# EAGLE design mcp661 (EAGLE 9.4.2)
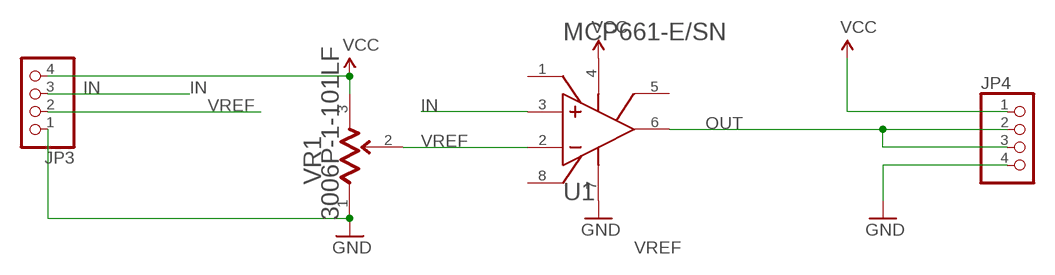
[diagram p0: schematic, sheet 1]

## Parts
JP3  PINHD-1X4  [1X04]
JP4  PINHD-1X4  [1X04]
U1  MICROCHIP_MCP661-E-SNMICROCHIP_MCP661-E-SN_0_2  [MICROCHIP_MCP661-E-SN_2]
VR1  BOURNS_3006P-1-101LFBOURNS_3006P-1-101LF_0_0  [BOURNS_3006P-1-101LF_0]

## Nets
GND: JP3.1 JP4.4 U1.7(VDD) VR1.1(CCW)
IN: JP3.3 U1.3(VIN+)
OUT: JP4.2 JP4.3 U1.6(VOUT)
VCC: JP3.4 JP4.1 U1.4(VSS) VR1.3(CW)
VREF: JP3.2 U1.2(VIN-) VR1.2(WIPER)
Unconnected: U1.1(1_NC) U1.5(2_NC) U1.8(3_NC)

## Library data of the parts
JP3 JP4 = pinhead:PINHD-1X4: PIN HEADER
U1 = SN:MICROCHIP_MCP661-E-SN: AMP-OPA-MCP601-IL8; CIIVA_IDS: 1325176; CODE__IPC: SOIC127P600-8; CODE__JEDEC: MS-012; COMPONENT_LINK_1_DESCRIPTION: Manufacturer URL; COMPONENT_LINK_1_URL: http://www.microchip.com/; COMPONENT_LINK_3_DESCRIPTION: Package Specification; COMPONENT_LINK_3_URL: http://www.microchip.com/stellent/groups/techpub_sg/documents/packagingspec/en012702.pdf; DATASHEET: http://ww1.microchip.com/downloads/en/DeviceDoc/22194C.pdf; DATASHEET_VERSION: revC, Nov-2011; FOOTPRINT_VARIANT_NAME_0: Level C; FOOTPRINT_VARIANT_NAME_1: Level B; FOOTPRINT_VARIANT_NAME_2: Level A; IMPORTED: yes; IMPORTED_FROM: vault; IMPORT_TS: 1521851511; MF: Microchip; MPN: MCP661-E/SN; PACKAGE: SOIC-SN8; PACKAGE_DESCRIPTION: 8-Lead Plastic Small Outline (SN) - Narrow, 3.90mm Body [SOIC]; PACKAGE_VERSION: revBB, Aug-2009; PREFIX: U; RELEASE_DATE: 1331952694; VAULT_GUID: 973559BF-ABD0-425F-8F5C-143CC353DD3C; VAULT_REVISION: DF713E88-1BB5-4496-A0BE-75F4F4915CB1
VR1 = Bourns - 3006P-1-101LF:BOURNS_3006P-1-101LF: Trimpot® Trimming Potentiometer; CAPACITANCE: TRIMMER 100 OHM 0.75W PC PIN; CENTROID_NOT_SPECIFIED: No; DATASHEET: http://www.bourns.com/docs/Product-Datasheets/3006.pdf; DIGIKEY_DESCRIPTION: RES TRIMMER 100 OHM 0.75W PC PIN; DIGIKEY_PART_NUMBER: 3006P-101LF-ND; LEAD_FREE: yes; MF: Bourns; MOUSER_PART_NUMBER: 652-3006P-1-101-LF; MPN: 3006P-1-101LF; PACKAGE: DIP_TRIMMER_19MM05_4MM83; PREFIX: VR; RESISTANCE: 100 Ohms; ROHS: yes; TEMPERATURE_RANGE_HIGH: +125°C; TEMPERATURE_RANGE_LOW: -55°C

## Net classes
0 default: width 0.254 mm, drill 0.254 mm, clearance 0.254 mm

## Board
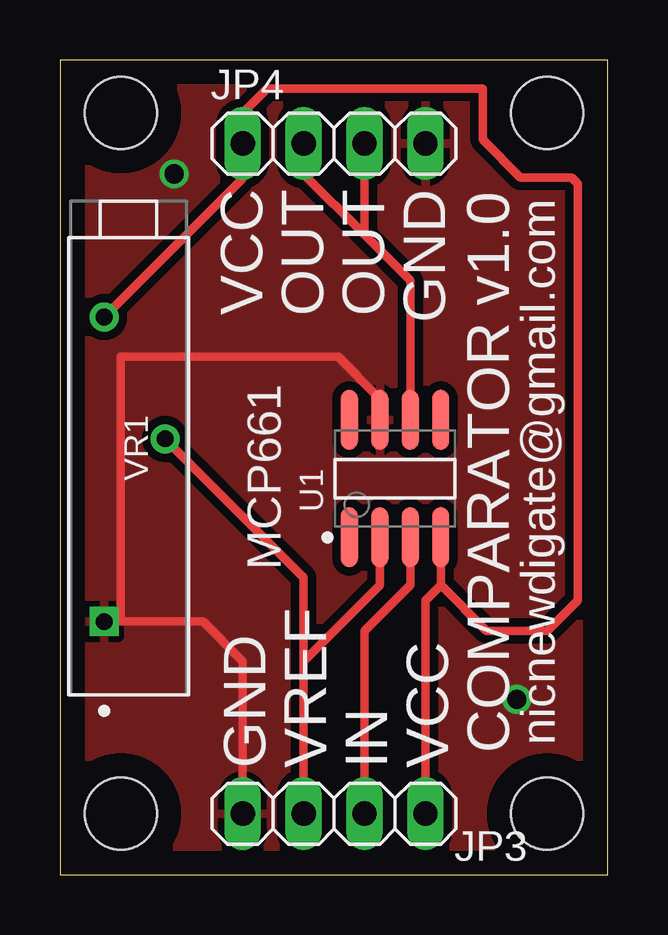
[diagram p1: board, top side]
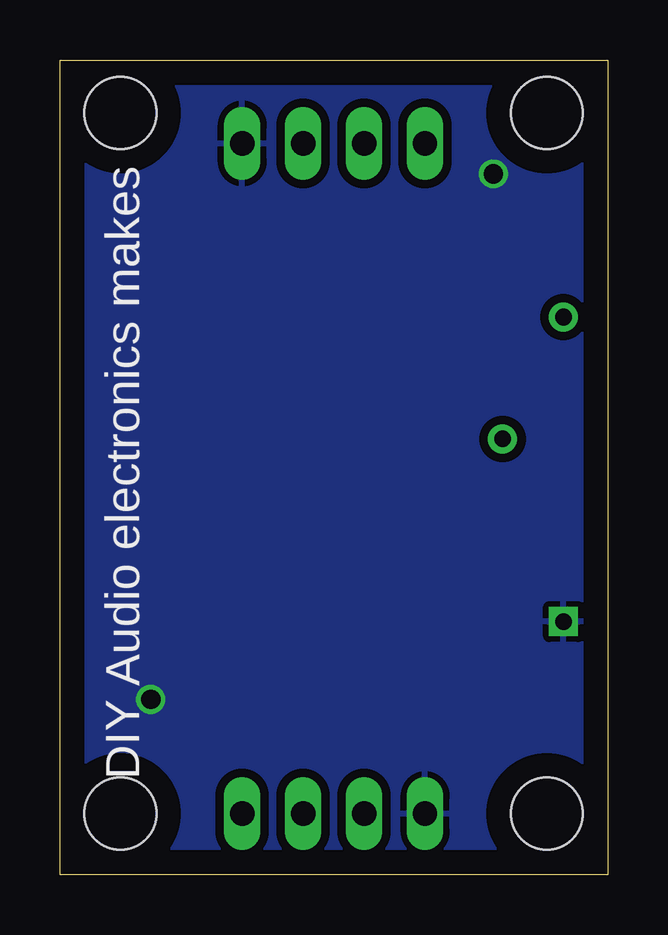
[diagram p2: board, bottom side, seen from below]

Size 22.84 x 33.96 mm. Coordinates in mm from the lower left corner, seen from the top.
Outline: 0,0 22.84,0 22.84,33.96 0,33.96 0,0
Copper layers (1*16): Top 0.035mm / dielectric 1.5mm / Bottom 0.035mm
Design rules "default": minimum track width 6mil, minimum drill 0.35mm, track to track 6mil, track to pad 6mil, pad to pad 6mil, via to via 6mil, smd to smd 6mil, copper to edge 40mil, drill to drill 6mil, minimum pad ring 10mil, minimum via ring 8mil, stop-mask expansion 4mil, vias tented up to drill 0mil, thermal gap 10mil
Holes 3 mm at 2.54,2.54 20.32,2.54 2.54,31.75 20.32,31.75

### Footprints (pad centres in the part's own frame; a part is rotated, then mirrored left to right if it is on the bottom)
1X04 = drill 1.016 long: 1 -3.81,0; 2 -1.27,0; 3 1.27,0; 4 3.81,0
MICROCHIP_MCP661-E-SN_2 = smd 2.5 x 0.7: 1 -2.45,1.905; 2 -2.45,0.635; 3 -2.45,-0.635; 4 -2.45,-1.905; 5 2.45,-1.905; 6 2.45,-0.635; 7 2.45,0.635; 8 2.45,1.905
BOURNS_3006P-1-101LF_0 = drill 0.7 pad 1.2 square: 1 -7.235,1.015 | drill 0.7 pad 1.2: 2 0.385,-1.525; 3 5.465,1.015

### Placement (x,y rotation side)
JP3  11.43,2.54 0 top
JP4  11.43,30.48 0 top
U1  13.97,16.51 90 top
VR1  2.86,17.78 90 top

### Tracks (layer width: path | path; a pad name or v marks a point on that pad's centre or on a via)
GND  (via drill 0.8)
  Top 0.356: JP3.1 7.62,8.89 5.96,10.54 VR1.1 2.54,10.54 2.54,21.59 11.58,21.59 13.27,19.91 13.27,19.03 U1.7
  other vias: 4.76,29.21 19.05,7.3
  pour Bottom: 0,34.29 24.13,34.29 24.13,0 24.13,-1.27 -1.27,-1.27 -1.27,34.29
  pour Top: 0.32,34.29 22.86,34.29 23.81,33.34 24.13,33.02 24.13,-0.64 23.18,-1.59 0.95,-1.59 -1.59,0.95 -1.59,31.11 -1.91,31.43 -1.91,32.07
IN
  Top 0.356: JP3.3 12.7,10.16 14.61,12.06 U1.3
OUT
  Top 0.356: U1.6 14.61,24.77 12.7,26.67 | 12.7,26.67 JP4.3 | 12.7,26.67 10.16,29.21 JP4.2
VCC
  Top 0.356: 15.88,12.06 17.78,10.16 20.32,10.16 21.59,11.43 21.59,28.8 21.34,29.06 19.2,29.06 17.63,30.63 17.63,32.77 8.64,32.77 7.62,31.75 JP4.1 7.62,29.02 VR1.3 | 15.88,12.06 U1.4 | JP3.4 15.24,11.43 15.88,12.06
VREF
  Top 0.356: JP3.2 10.16,8.89 | U1.2 13.34,12.06 10.16,8.89 | VR1.2 10.16,12.39 10.16,8.89

### Text on the board
tNames: VCC | OUT | OUT | GND | MCP661 | COMPARATOR v1.0 | nicnewdigate@gmail.com | GND | VREF | IN | VCC
bNames: DIY Audio electronics makes